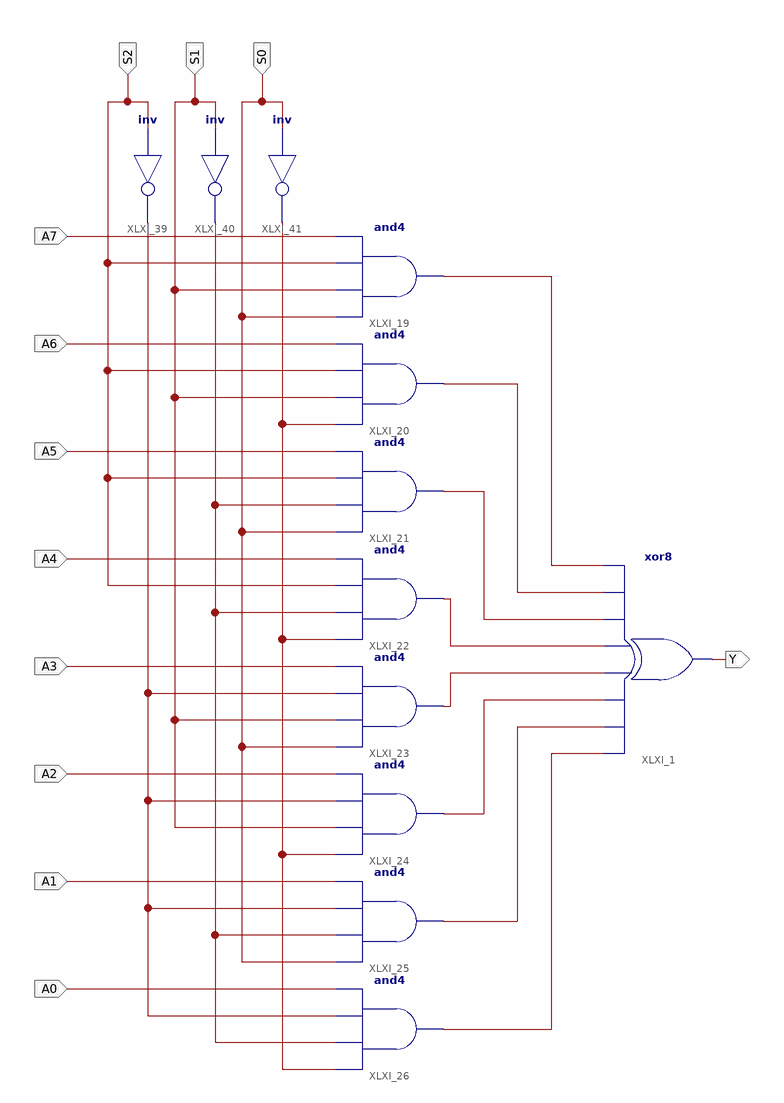
[diagram p0: schematic sheet 1]
// Xilinx ISE schematic mux8to1.sch (spartan6) as structural Verilog: 12 symbols, 12 ports
module mux8to1 (
  input  S0,
  input  A1,
  input  A2,
  input  A3,
  input  A4,
  input  A5,
  input  A6,
  input  A0,
  input  A7,
  input  S2,
  input  S1,
  output Y
);

  wire XLXN_32, XLXN_40, XLXN_103, XLXN_115, XLXN_347, XLXN_350, XLXN_362, XLXN_363, XLXN_364, XLXN_365,
       XLXN_366;

  xor XLXI_1 (Y, XLXN_40, XLXN_347, XLXN_364, XLXN_362, XLXN_363, XLXN_365, XLXN_366, XLXN_32);
  not XLXI_39 (XLXN_103, S2);
  not XLXI_40 (XLXN_115, S1);
  not XLXI_41 (XLXN_350, S0);
  and XLXI_26 (XLXN_40, XLXN_350, XLXN_115, XLXN_103, A0);
  and XLXI_25 (XLXN_347, S0, XLXN_115, XLXN_103, A1);
  and XLXI_24 (XLXN_364, XLXN_350, S1, XLXN_103, A2);
  and XLXI_23 (XLXN_362, S0, S1, XLXN_103, A3);
  and XLXI_22 (XLXN_363, XLXN_350, XLXN_115, S2, A4);
  and XLXI_21 (XLXN_365, S0, XLXN_115, S2, A5);
  and XLXI_20 (XLXN_366, XLXN_350, S1, S2, A6);
  and XLXI_19 (XLXN_32, S0, S1, S2, A7);
endmodule
